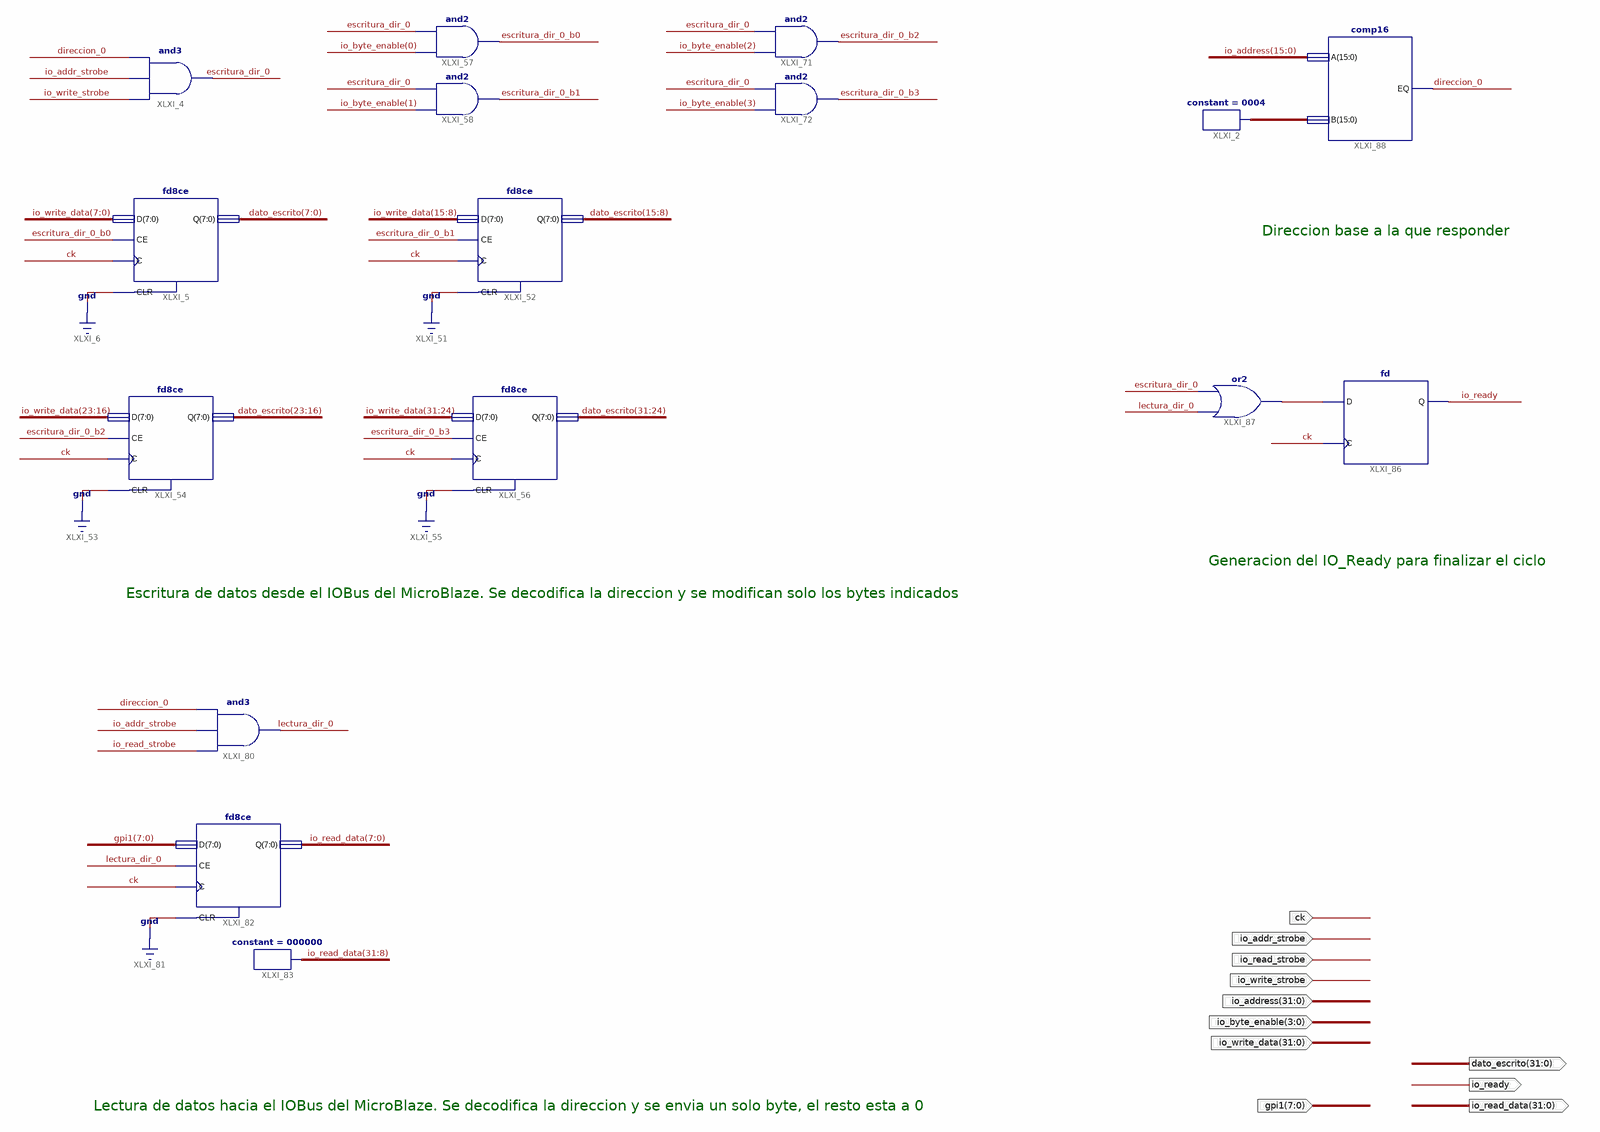
[diagram p0: schematic sheet 1]
// Xilinx ISE schematic iobus_salida.sch (spartan6) as structural Verilog: 16 symbols, 11 ports
module iobus_salida (
  input  io_write_strobe,
  input  io_addr_strobe,
  input  ck,
  input  io_read_strobe,
  input  [7:0] gpi1,
  input  [3:0] io_byte_enable,
  input  [31:0] io_address,
  input  [31:0] io_write_data,
  output io_ready,
  output [31:0] dato_escrito,
  output [31:0] io_read_data
);

  wire direccion_0, escritura_dir_0, escritura_dir_0_b0, escritura_dir_0_b1, escritura_dir_0_b2,
       escritura_dir_0_b3, lectura_dir_0, XLXN_282;
  wire [15:0] XLXN_283;

  fd8ce XLXI_5 (.C(ck), .CE(escritura_dir_0_b0), .CLR(1'b0), .D(io_write_data[7:0]), .Q(dato_escrito[7:0]));
  fd8ce XLXI_54 (.C(ck), .CE(escritura_dir_0_b2), .CLR(1'b0), .D(io_write_data[23:16]), .Q(dato_escrito[23:16]));
  fd8ce XLXI_56 (.C(ck), .CE(escritura_dir_0_b3), .CLR(1'b0), .D(io_write_data[31:24]), .Q(dato_escrito[31:24]));
  fd8ce XLXI_52 (.C(ck), .CE(escritura_dir_0_b1), .CLR(1'b0), .D(io_write_data[15:8]), .Q(dato_escrito[15:8]));
  and XLXI_4 (escritura_dir_0, io_write_strobe, io_addr_strobe, direccion_0);
  and XLXI_57 (escritura_dir_0_b0, io_byte_enable[0], escritura_dir_0);
  and XLXI_58 (escritura_dir_0_b1, io_byte_enable[1], escritura_dir_0);
  and XLXI_71 (escritura_dir_0_b2, io_byte_enable[2], escritura_dir_0);
  and XLXI_72 (escritura_dir_0_b3, io_byte_enable[3], escritura_dir_0);
  constant #(.CValue("0004")) XLXI_2 (.O(XLXN_283));
  fd XLXI_86 (.C(ck), .D(XLXN_282), .Q(io_ready));
  or XLXI_87 (XLXN_282, lectura_dir_0, escritura_dir_0);
  and XLXI_80 (lectura_dir_0, io_read_strobe, io_addr_strobe, direccion_0);
  fd8ce XLXI_82 (.C(ck), .CE(lectura_dir_0), .CLR(1'b0), .D(gpi1), .Q(io_read_data[7:0]));
  constant #(.CValue("000000")) XLXI_83 (.O(io_read_data[31:8]));
  comp16 XLXI_88 (.A(io_address[15:0]), .B(XLXN_283), .EQ(direccion_0));

  // Notes on the sheet:
  //   Direccion base a la que responder
  //   Generacion del IO_Ready para finalizar el ciclo
  //   Escritura de datos desde el IOBus del MicroBlaze. Se decodifica la direccion y se modifican solo los bytes indicados
  //   Lectura de datos hacia el IOBus del MicroBlaze. Se decodifica la direccion y se envia un solo byte, el resto esta a 0
endmodule
